# EAGLE design primero (EAGLE 9.2.2)
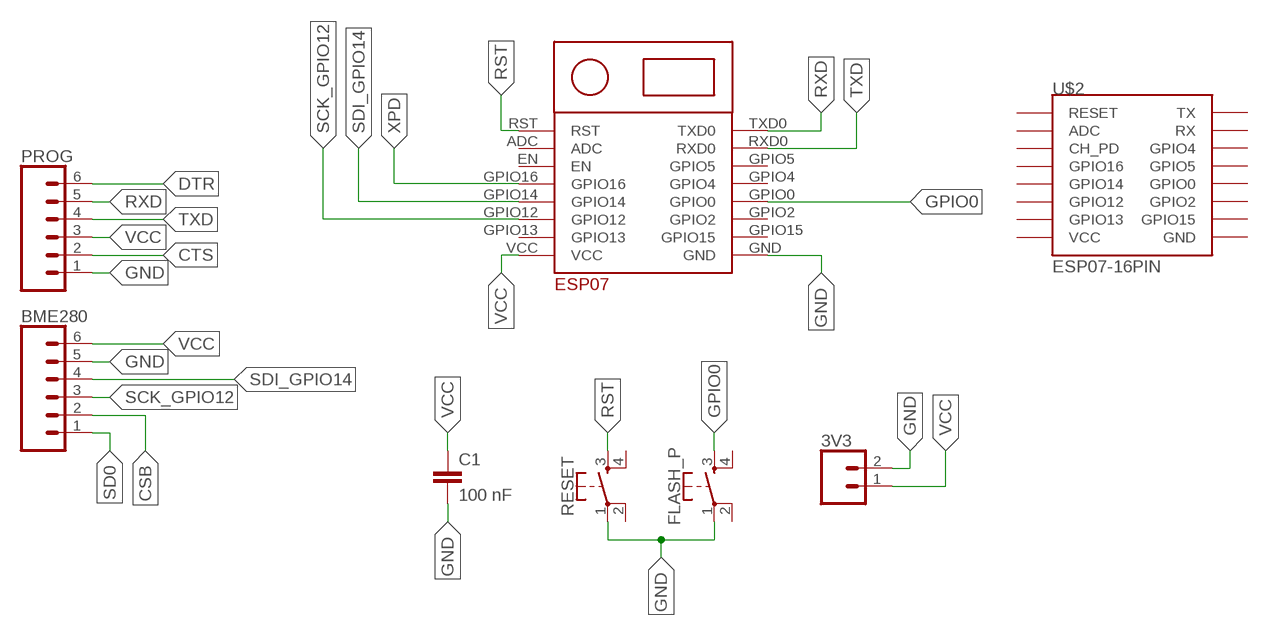
[diagram p0: schematic, sheet 1]

## Parts
3V3  CONN_02JST-PTH-2  [JST-2-PTH]
BME280  CONN_06SILK_FEMALE_PTH  [1X06]
C1  100 nF  C-EUC0805  [C0805]
FLASH_P  MOMENTARY-SWITCH-SPST-2-SMD-4.6X2.8MM  [TACTILE_SWITCH_SMD_4.6X2.8MM]
PROG  CONN_06SILK_FEMALE_PTH  [1X06]
RESET  MOMENTARY-SWITCH-SPST-2-SMD-4.6X2.8MM  [TACTILE_SWITCH_SMD_4.6X2.8MM]
U$1  ESP-07ESP07  [ESP-07_MM]
U$2  ESP07-16PIN  [ESP07-16PIN]

## Nets
CSB: BME280.2
CTS: PROG.2
DTR: PROG.6
GND: 3V3.2 BME280.5 C1.2 FLASH_P.1 PROG.1 RESET.1 U$1.GND
GPIO0: FLASH_P.3 U$1.GPIO0
RST: RESET.3 U$1.RST
RXD: PROG.5 U$1.TXD0
SCK_GPIO12: BME280.3 U$1.GPIO12
SD0: BME280.1
SDI_GPIO14: BME280.4 U$1.GPIO14
TXD: PROG.4 U$1.RXD0
VCC: 3V3.1 BME280.6 C1.1 PROG.3 U$1.VCC
XPD: U$1.GPIO16
Unconnected: FLASH_P.2 FLASH_P.4 RESET.2 RESET.4 U$1.ADC U$1.EN U$1.GPIO2 U$1.GPIO4 U$1.GPIO5 U$1.GPIO13 U$1.GPIO15 U$2.ADC U$2.CH_PD U$2.GND U$2.GPIO0 U$2.GPIO2 U$2.GPIO4 U$2.GPIO5 U$2.GPIO12 U$2.GPIO13 U$2.GPIO14 U$2.GPIO15 U$2.GPIO16 U$2.REST(RESET) U$2.RX U$2.TX U$2.VCC

## Library data of the parts
3V3 = SparkFun-Connectors:CONN_02: Multi connection point. Often used as Generic Header-pin footprint for 0.1 inch spaced/style header connections On any of the 0.1 inch spaced packages, you can populate with these: Break Away Headers - Straight <https://www.sparkfun.com/products/116> (PRT-00116) Break Away Male Headers - Right Angle <https://www.sparkfun.com/products/553> (PRT-00553) Female Headers <https://www.sparkfun.com/products/115> (PRT-00115) Break Away Headers - Machine Pin <https://www.sparkfun.com/products/117> (PRT-00117) Break Away Female Headers - Swiss Machine Pin <https://www.sparkfun.com/products/743> (PRT-00743) For SCREWTERMINALS and SPRING TERMINALS visit here: Screw Terimnals on SparkFun.com <https://www.sparkfun.com/search/results?term=Screw+Terminals> (5mm/3.5mm/2.54mm spacing) This device is also useful as a general connection point to wire up your design to another part of your project. Our various solder wires solder well into these plated through hole pads. Hook-Up Wire - Assortment (Stranded, 22 AWG) <https://www.sparkfun.com/products/11375> (PRT-11375) Hook-Up Wire - Assortment (Solid Core, 22 AWG) <https://www.sparkfun.com/products/11367> (PRT-11367) View the entire wire category on our website here <https://www.sparkfun.com/categories/141> Special notes: Molex polarized connector foot print use with: PRT-08233 with associated crimp pins and housings. 2.54_SCREWTERM for use with PRT-10571. 3.5mm Screw Terminal footprints for PRT-08084 5mm Screw Terminal footprints for use with PRT-08432; PROD_ID: CONN-09863; SKU: PRT-09914
BME280 PROG = SparkFun-Connectors:CONN_06: Multi connection point. Often used as Generic Header-pin footprint for 0.1 inch spaced/style header connections On any of the 0.1 inch spaced packages, you can populate with these: Break Away Headers - Straight <https://www.sparkfun.com/products/116> (PRT-00116) Break Away Male Headers - Right Angle <https://www.sparkfun.com/products/553> (PRT-00553) Female Headers <https://www.sparkfun.com/products/115> (PRT-00115) Break Away Headers - Machine Pin <https://www.sparkfun.com/products/117> (PRT-00117) Break Away Female Headers - Swiss Machine Pin <https://www.sparkfun.com/products/743> (PRT-00743) Arduino Stackable Header - 6 Pin <https://www.sparkfun.com/products/9280> (PRT-09280) For SCREWTERMINALS and SPRING TERMINALS visit here: Screw Terimnals on SparkFun.com <https://www.sparkfun.com/search/results?term=Screw+Terminals> (5mm/3.5mm/2.54mm spacing) This device is also useful as a general connection point to wire up your design to another part of your project. Our various solder wires solder well into these plated through hole pads. Hook-Up Wire - Assortment (Stranded, 22 AWG) <https://www.sparkfun.com/products/11375> (PRT-11375) Hook-Up Wire - Assortment (Solid Core, 22 AWG) <https://www.sparkfun.com/products/11367> (PRT-11367) View the entire wire category on our website here <https://www.sparkfun.com/categories/141>; PROD_ID: CONN-08437
C1 = rcl:C-EU: CAPACITOR, European symbol; SPICEPREFIX: C
FLASH_P RESET = SparkFun-Switches:MOMENTARY-SWITCH-SPST-2: Momentary Switch (Pushbutton) - SPST - Two Circuits Normally-open (NO) SPST momentary switches (buttons, pushbuttons). Schematic symbol includes two switch circuits. Variants SMD-4.6MMX2.8MM - 4.60mm x 2.80mm Tactile Momentary Button Switch - Used on SparkFun SAMD21 Mini Breakout <https://www.sparkfun.com/products/13664> SMD-5.2MM - Mini Pushbutton Switch - SMD <https://www.sparkfun.com/products/8720> - Used on Arduino Pro Mini <https://www.sparkfun.com/products/11114>; PROD_ID: SWCH-13065
U$1 = esp8266_danielsr:ESP-07: ESP8266 ESP07
U$2 = esp8266modules:ESP07-16PIN: ESP8266 Wifi module 07 - 16 pins; DIMENSIONS: 22.0 x 16.0 mm; PINS: 16; PITCH: 0.078" / 2 mm

## Board
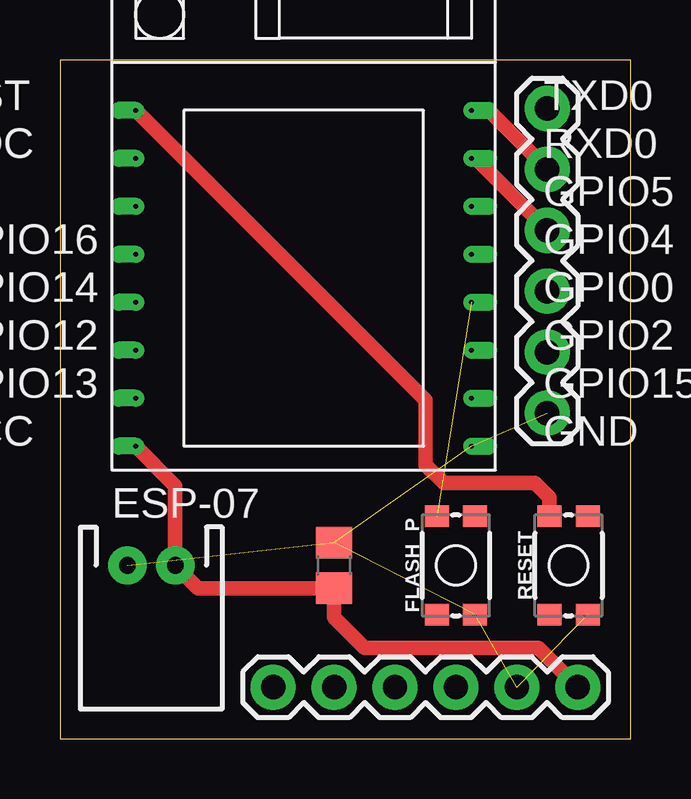
[diagram p1: board, top side]
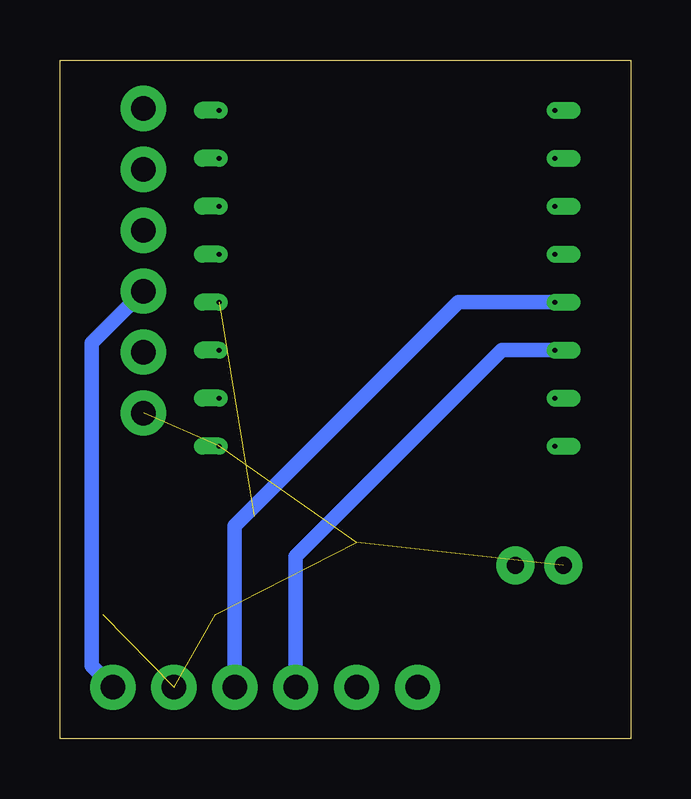
[diagram p2: board, bottom side, seen from below]

Size 23.8 x 28.31 mm. Coordinates in mm from the lower left corner, seen from the top.
Outline: 0,0 23.8,0 23.8,28.31 0,28.31 0,0
Copper layers (1*16): Top 0.035mm / dielectric 1.5mm / Bottom 0.035mm
Design rules "default": minimum track width 6mil, minimum drill 0.35mm, track to track 6mil, track to pad 6mil, pad to pad 6mil, via to via 6mil, smd to smd 6mil, copper to edge 40mil, drill to drill 6mil, minimum pad ring 10mil, minimum via ring 8mil, stop-mask expansion 4mil, vias tented up to drill 0mil, thermal gap 10mil

### Footprints (pad centres in the part's own frame; a part is rotated, then mirrored left to right if it is on the bottom)
JST-2-PTH = drill 0.7 pad 1.6: 1 -1,0; 2 1,0
1X06 = drill 1.016 pad 1.88: 1 0,0; 2 2.54,0; 3 5.08,0; 4 7.62,0; 5 10.16,0; 6 12.7,0
C0805 = smd 1.3 x 1.5: 1 -0.95,0; 2 0.95,0
TACTILE_SWITCH_SMD_4.6X2.8MM = smd 0.9 x 1: 1 -2.05,-0.8; 2 2.05,-0.8; 3 2.05,0.8; 4 -2.05,0.8
ESP-07_MM = drill 0.2 offset: ADC -7,3; EN -7,1; GND 7,-9; GPIO0 7,-3; GPIO2 7,-5; GPIO4 7,-1; GPIO5 7,1; GPIO12 -7,-5; GPIO13 -7,-7; GPIO14 -7,-3; GPIO15 7,-7; GPIO16 -7,-1; RST -7,5; RXD0 7,3; TXD0 7,5; VCC -7,-9
ESP07-16PIN = smd 2.5 x 1: ADC -8.2,3.8; CH_PD -8.2,1.8; GND 8.2,-8.105; GPIO0 8.2,-2.2; GPIO2 8.2,-4.2; GPIO4 8.2,1.8; GPIO5 8.2,-0.2; GPIO12 -8.2,-4.2; GPIO13 -8.2,-6.2; GPIO14 -8.2,-2.2; GPIO15 8.2,-6.2; GPIO16 -8.2,-0.2; REST -8.2,5.8; RX 8.2,3.8; TX 8.2,5.8; VCC -8.2,-8.105

### Placement (x,y rotation side)
3V3  3.81,7.24 180 top
BME280  8.89,2.16 0 top
C1  11.43,7.24 90 top
FLASH_P  16.51,7.24 90 top
PROG  20.32,13.59 90 top
RESET  21.21,7.24 90 top
U$1  10.16,21.21 0 top
U$2  -15.24,12.7 0 top  (outside the outline)

### Tracks (layer width: path | path; a pad name or v marks a point on that pad's centre or on a via)
GND  (6 unrouted)
GPIO0  (1 unrouted)
RST
  Top 0.61: U$1.RST 15.24,14.13 15.24,11.43 16,10.67 19.81,10.67 20.41,10.07 RESET.3
RXD
  Top 0.61: PROG.5 17.86,26.21 U$1.TXD0
SCK_GPIO12
  Bottom 0.61: BME280.3 13.97,7.62 5.38,16.21 U$1.GPIO12
SDI_GPIO14
  Bottom 0.61: U$1.GPIO14 7.19,18.21 16.51,8.89 BME280.4
TXD
  Top 0.61: PROG.4 17.32,24.21 U$1.RXD0
VCC
  Top 0.61: U$1.VCC 4.81,10.56 3V3.1 5.76,6.29 C1.1 11.43,5.08 12.7,3.81 19.94,3.81 BME280.6
  Bottom 0.61: BME280.6 22.48,3.05 22.48,16.51 PROG.3 | PROG.3